# Altium project Safety Thermocouple Interface - No OC detect.PrjPcb
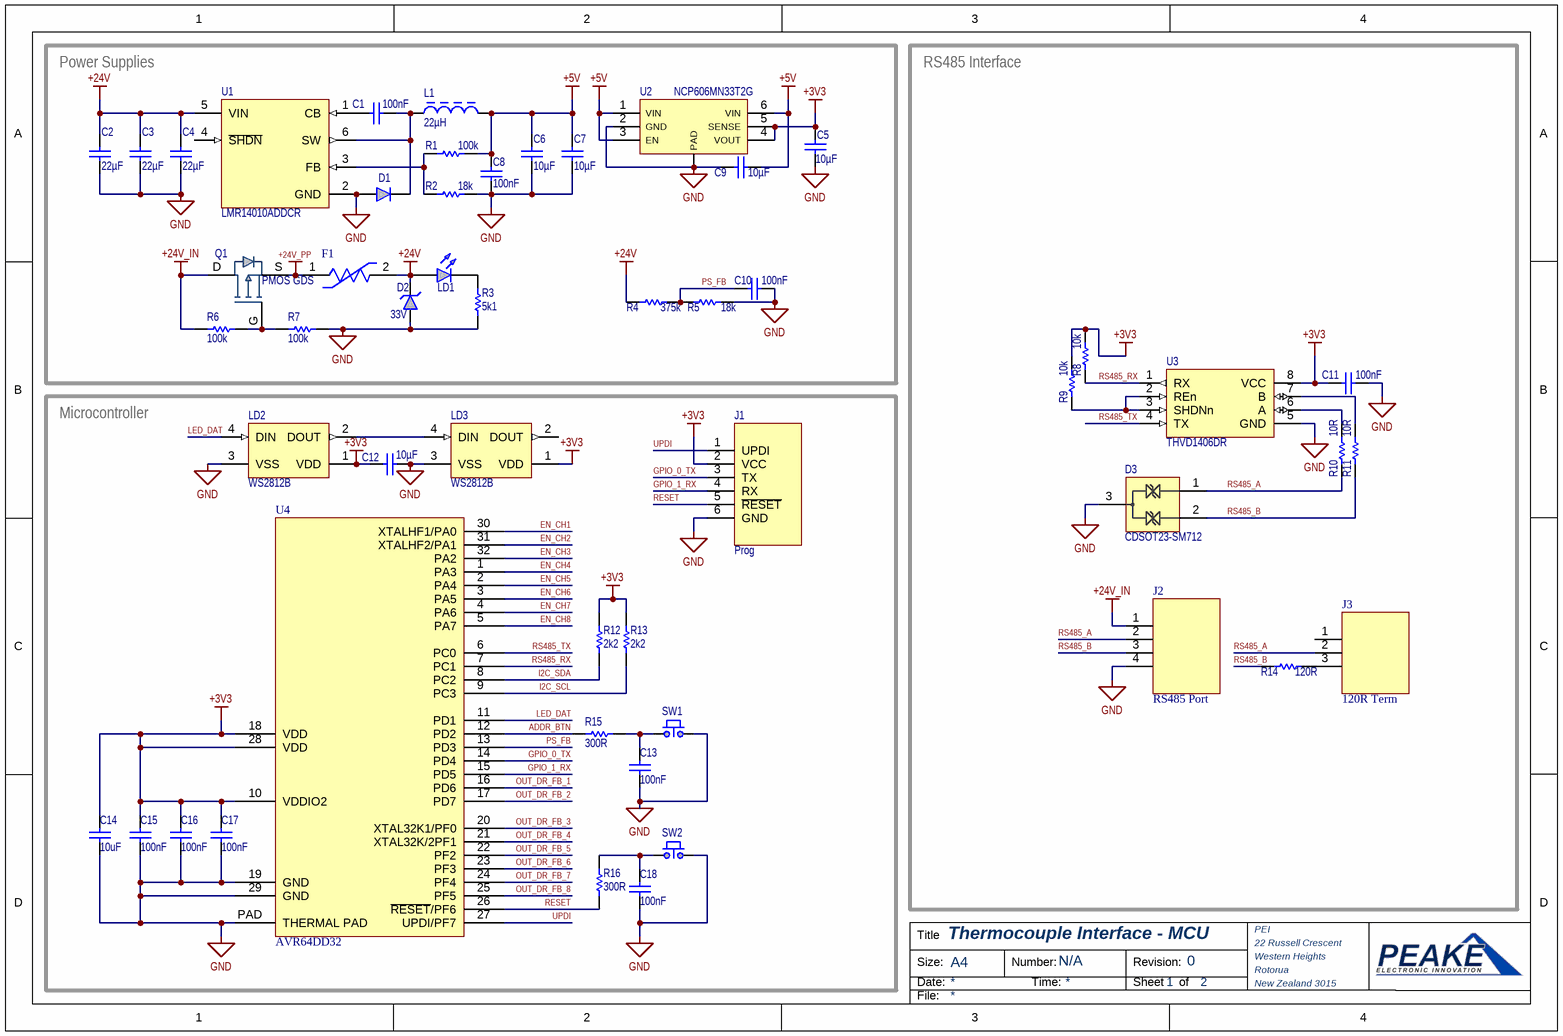
[diagram p0: Safety Thermocouple Interface - MCU.SchDoc]
2 sheets, 184 parts. Net scope: global (net labels, ports and power ports of the same name join across sheets).
Board file: Safety Thermocouple Interface.PcbDoc
Sheets:
  Safety Thermocouple Interface - MCU.SchDoc
  Safety Thermocouple Interface - IO.SchDoc

## Sheet Safety Thermocouple Interface - MCU.SchDoc: Thermocouple Interface - MCU
size A4; Organization: PEI; Address1: 22 Russell Crescent; Address2: Western Heights; Address3: Rotorua; Address4: New Zealand 3015; DocumentNumber: N/A; Revision: 0; SheetNumber: 1; SheetTotal: 2

### Parts
C1  value 100nF  [0603_CAP]  (hidden comment: Capacitor)
C2  value 22µF  [1206_CAP]  (hidden comment: Capacitor)
C3  value 22µF  [1206_CAP]  (hidden comment: Capacitor)
C4  value 22µF  [1206_CAP]  (hidden comment: Capacitor)
C5  value 10µF  [0603_CAP]  (hidden comment: Capacitor)
C6  value 10µF  [0603_CAP]  (hidden comment: Capacitor)
C7  value 10µF  [0603_CAP]  (hidden comment: Capacitor)
C8  value 100nF  [0603_CAP]  (hidden comment: Capacitor)
C9  value 10µF  [0603_CAP]  (hidden comment: Capacitor)
C10  value 100nF  [0603_CAP]  (hidden comment: Capacitor)
C11  value 100nF  [0603_CAP]  (hidden comment: Capacitor)
C12  value 10µF  [0603_CAP]  (hidden comment: Capacitor)
C13  value 100nF  [0603_CAP]  (hidden comment: Capacitor)
C14  value 10uF  [0603_CAP]  (hidden comment: Capacitor)
C15  value 100nF  [0603_CAP]  (hidden comment: Capacitor)
C16  value 100nF  [0603_CAP]  (hidden comment: Capacitor)
C17  value 100nF  [0603_CAP]  (hidden comment: Capacitor)
C18  value 100nF  [0603_CAP]  (hidden comment: Capacitor)
D1  Diode  [SOD-123]  (value not drawn)
D2  Rated Voltage: 33V  [SMBJ]  (hidden comment: Transil)
D3  CDSOT23-SM712  [FP-SOT23-IPC_C]
F1  0ZCF0100AF2A  [FP-0ZCF0100AF2A-MFG]  (value not drawn)
J1  Prog  [DIP6]
J2  RS485 Port  [4_Pin  DB2EVC-3.81-4P-GN LCSC version]
J3  120R Term  [SIP3]
L1  value 22µH  [BOUR-SRN8040_V]  (hidden comment: Inductor)
LD1  LED  [0805]  (value not drawn)
LD2  WS2812B  [WS2812B-2020]
LD3  WS2812B  [WS2812B-2020]
Q1  PMOS GDS  [PowerDI 5060-8]
R1  value 100k  [0603_RES]  (hidden comment: Resistor)
R2  value 18k  [0603_RES]  (hidden comment: Resistor)
R3  value 5k1  [0603_RES]  (hidden comment: Resistor)
R4  value 375k  [0603_RES]  (hidden comment: Resistor)
R5  value 18k  [0603_RES]  (hidden comment: Resistor)
R6  value 100k  [0603_RES]  (hidden comment: Resistor)
R7  value 100k  [0603_RES]  (hidden comment: Resistor)
R8  value 10k  [0603_RES]  (hidden comment: Resistor)
R9  value 10k  [0603_RES]  (hidden comment: Resistor)
R10  value 10R  [0603_RES]  (hidden comment: Resistor)
R11  value 10R  [0603_RES]  (hidden comment: Resistor)
R12  value 2k2  [0603_RES]  (hidden comment: Resistor)
R13  value 2k2  [0603_RES]  (hidden comment: Resistor)
R14  value 120R  [0603_RES]  (hidden comment: Resistor)
R15  value 300R  [0603_RES]  (hidden comment: Resistor)
R16  value 300R  [0603_RES]  (hidden comment: Resistor)
SW1  EVP-AAN02Q  [FP-EVP-AAN02Q-MFG]  (value not drawn)
SW2  EVP-AAN02Q  [FP-EVP-AAN02Q-MFG]  (value not drawn)
U1  LMR14010ADDCR  [FP-DDC0006A-IPC_A]
U2  NCP606MN33T2G  [QFN95P330X295X100_HS-7N]
U3  THVD1406DR  [SOIC127P600X175-8N]
U4  AVR64DD32  [32P VQFN]

### Blocks framed on the sheet
Power Supplies: C1-C10 D1 D2 F1 L1 LD1 Q1 R1-R7 U1 U2
RS485 Interface: C11 D3 J2 J3 R8-R11 R14 U3
Microcontroller: C12-C18 J1 LD2 LD3 R12 R13 R15 R16 SW1 SW2 U4

### Nets
+3V3: C5.1 C11.2 C12.2 C14.2 C15.2 C16.2 C17.2 J1.2(VCC) LD2.1(VDD) LD3.1(VDD) R8.1 R9.1 R12.1 R13.1 U2.4(VOUT) U2.5(SENSE) U3.8(VCC) U4.10(VDDIO2) U4.18(VDD) U4.28(VDD)
+5V: C6.1 C7.1 C8.1 C9.1 L1.2 R1.2 U2.1(VIN) U2.3(EN) U2.6(VIN)
+24V: C2.1 C3.1 C4.1 D2.2(K) F1.2 LD1.2(A) R4.1 U1.5(VIN)
+24V_IN: J2.1 Q1.D R6.1
+24V_PP: F1.1 Q1.S
GND: C2.2 C3.2 C4.2 C5.2 C6.2 C7.2 C8.2 C9.2 C10.2 C11.1 C12.1 C13.1 C14.1 C15.1 C16.1 C17.1 C18.1 D1.2(A) D2.1(A) D3.3 J1.6(GND) J2.4 LD2.3(VSS) LD3.3(VSS) R2.2 R3.2 R5.1 R7.2 SW1.2 SW2.2 U1.2(GND) U2.2(GND) U2.PAD U3.5(GND) U4.19(GND) U4.29(GND) U4.PAD(THERMAL_PAD)
ADDR_BTN: R15.2 U4.12(PD2)
EN_CH1: U4.30(XTALHF1/PA0)
EN_CH2: U4.31(XTALHF2/PA1)
EN_CH3: U4.32(PA2)
EN_CH4: U4.1(PA3)
EN_CH5: U4.2(PA4)
EN_CH6: U4.3(PA5)
EN_CH7: U4.4(PA6)
EN_CH8: U4.5(PA7)
GPIO_0_TX: J1.3(TX) U4.14(PD4)
GPIO_1_RX: J1.4(RX) U4.15(PD5)
I2C_SCL: R13.2 U4.9(PC3)
I2C_SDA: R12.2 U4.8(PC2)
LED_DAT: LD2.4(DIN) U4.11(PD1)
OUT_DR_FB_1: U4.16(PD6)
OUT_DR_FB_2: U4.17(PD7)
OUT_DR_FB_3: U4.20(XTAL32K1/PF0)
OUT_DR_FB_4: U4.21(XTAL32K/2PF1)
OUT_DR_FB_5: U4.22(PF2)
OUT_DR_FB_6: U4.23(PF3)
OUT_DR_FB_7: U4.24(PF4)
OUT_DR_FB_8: U4.25(PF5)
PS_FB: C10.1 R4.2 R5.2 U4.13(PD3)
RESET: J1.5(~{RESET}) R16.1 U4.26(~{RESET}/PF6)
RS485_A: D3.1 J2.2 J3.2 R10.1
RS485_B: D3.2 J2.3 R11.1 R14.1
RS485_RX: R8.2 U3.1(RX) U4.7(PC1)
RS485_TX: U3.4(TX) U4.6(PC0)
UPDI: J1.1(UPDI) U4.27(UPDI/PF7)
NetC1_1: C1.1 D1.1(K) L1.1 U1.6(SW)
NetC1_2: C1.2 U1.1(CB)
NetC13_2: C13.2 R15.1 SW1.1
NetC18_2: C18.2 R16.2 SW2.1
NetJ3_3: J3.3 R14.2
NetLD1_1: LD1.1(K) R3.1
NetLD2_2: LD2.2(DOUT) LD3.4(DIN)
NetQ1_G: Q1.G R6.2 R7.1
NetR1_1: R1.1 R2.1 U1.3(FB)
NetR9_2: R9.2 U3.2(REn) U3.3(SHDNn)
NetR10_2: R10.2 U3.6(A)
NetR11_2: R11.2 U3.7(B)

Not connected (* = marked no-connect by the designer): J3 1; LD3 2(DOUT); U1 4(~{SHDN})

### Notes on the sheet
- Title
- Size:
- Date:
- A4
- Number:
- Time:
- Revision:
- Sheet
- of
- File:

### Library data of the parts
C1-C12 = CMP-001-00172-2: SMD Capacitor; Pins: 2; Source: Discrete.SchLib; Design Item ID: Capacitor; Component Type: Standard
C13-C18 = CMP-001-00172-1: SMD Capacitor; Pins: 2; Source: Discrete.SchLib; Component Type: Standard; Design Item ID: Capacitor
D1 = CMP-004-00083-4: SMD Diode; Design Item ID: Diode; Pins: 2; Source: Discrete.SchLib; Component Type: Standard; Pin Count: 2
D2 = CMP-079-000108-2: Transient Voltage Suppressor; MFN: SMBJ33A; Component Type: Standard; Pin Count: 2; Source: Discrete.SchLib; Breakdown Voltage: *; Design Item ID: Transil; Clamping Voltage: *
D3 = CDSOT23-SM712-3: Trans Voltage Suppressor Diode, 400W, 7V V(RWM), Bidirectional, 2 Element, Silicon; Number of Elements: 2; Min Breakdown Voltage: 7.5V; Qualification Status: Not Qualified; Clamping Voltage-Max: 19V; Reference Standard: IEC-61000-4-2; Package Body Material: Plastic; Technology: AVALANCHE; JESD-30 Code: R-PDSO-G3; Moisture Sensitivity Level: 1; Polarity: Bidirectional; Diode Element Material: SILICON; Rep Pk Reverse Voltage-Max: 7V; JESD-609 Code: e3; Non-rep Peak Rev Power Dis-Max: 400W; Diode Type: TRANS VOLTAGE SUPPRESSOR; Package Style: SMALL OUTLINEMeter; Pins: 3; Surface Mount: Yes; Breakdown Voltage-Nom: 7.5V; Reach SVHC Compliant: Yes; Package Shape: Rectangular; Terminal Form: Gull Wing; RoHS Compliant: Yes; Terminal Position: DUAL; Terminal Finish: Tin
F1 = CMP-005-00014-2: PTC Resettable Fuse 100A 0.5s 60VDC 0.09 Ohm 2-Pin 2920 T/R; Time to Trip: 500ms; Hold Current: 1A; Trip Current: 2A; Pins: 2; Component Type: Standard; Thickness: 0.067inch; Width: 0.202inch; Series: 0ZCF; Max Operating Temperature: 85°C; Source: All Components - 30.06.23 - 18.27.SchLib; Min Operating Temperature: -40°C; Design Item ID: CMP-00051-1; Length: 0.29inch; Case/Package: 2920; RoHS Compliant: Yes; Packaging: Cut Tape; Max Current Rating: 100A; Case Code (Metric): 7351; Mount: Surface Mount
J1 = CMP-002-00180-1: 6 Pin Connector; Component Type: Standard; Design Item ID: 6_Pin; Pins: 6; Source: Connectors.SchLib; Pin Count: 6
J2 = CMP-002-00177-3: 4 Pin Connector; Pins: 4; Design Item ID: 4_Pin; Component Type: Standard; Pin Count: 4; Source: Connectors.SchLib
J3 = CMP-002-00174-3: 3 Pin Connector; Pin Count: 3; Source: Connectors.SchLib; Pins: 3; Component Type: Standard; Design Item ID: 3_Pin
L1 = CMP-006-00052-2: Power Inductor; DCR: 100mR; Current Rating: 2.2A; Pins: 2; Component Type: Standard; Design Item ID: Inductor; Source: Discrete.SchLib; Pin Count: 2; MFN: *
LD1 = CMP-004-00084-3: SMD LED; Colour: RED; Pins: 2; Source: Discrete.SchLib; Design Item ID: LED; Component Type: Standard; Pin Count: 2
LD2 LD3 = CMP-079-000113-2: Intelligent Control LED Integrated Light Source, 3.5 to 5.3 V, -25 to 80 degC, 4-Pin SMD, RoHS, Bulk; Manufacturer: Adafruit Industries; Mounting Technology: SM; RoHS Compliant: False; Package Reference: WS2812B; Case/Package: WS2812B; Component Type: Standard; Manufacturer URL: https://www.adafruit.com/; Package Description: 4-Pin Surface Mount Device, Body 5 x 5 mm, Pitch 3.3 mm; Source: All Components - 30.06.23 - 18.27.SchLib; Datasheet Version: May-13; Datasheet URL: https://cdn-shop.adafruit.com/datasheets/WS2812B.pdf; Pin Count: 4; Design Item ID: CMP-007-00035-3
Q1 = CMP-079-000102-2: P Channel MOSFET; MFN: *; Design Item ID: PMOS GDS; VGS Max: *; Continuous Current: *; VDS Breakdown: *; Source: P-MOS.SchLib; Component Type: Standard; Pin Count: 3
R1-R16 = CMP-009-00356-1: SMD Resistor; Pins: 2; Source: Discrete.SchLib; Component Type: Standard; Design Item ID: Resistor
SW1 SW2 = CMP-011-00000-2: Switch Tactile N.O. SPST Rectangular Button J-Bend 0.02A 15VDC 100000Cycles 5N SMD T/R
U1 = CMP-079-000005-5: 7-40VDC-DC buck converter; Number of Outputs: 1; Max Output Voltage: 40V; Output Current: 1A; Min Input Voltage: 4V; Output Type: Adjustable; Synchronous Rectifier: No; Min Output Voltage: 765mV; Output Configuration: Positive; Switching Frequency: 850kHz; Max Operating Temperature: 125°C; Case/Package: SOT-23-6; Features: UVLO; Pin Count: 6; Packaging: Cut Tape; Mount: Surface Mount; Component Type: Standard; Min Operating Temperature: -40°C; Max Input Voltage: 40V; Source: All Components - 30.06.23 - 18.27.SchLib; Design Item ID: CMP-00007-1
U2 = CMP-019-00001-1: Fixed Positive LDO Regulator, 3.3V, 0.22V Dropout, CMOS; Max Supply Voltage: 6V; RoHS Compliant: Yes; Case/Package: HVSON; Pins: 6
U3 = CMP-015-00008-1: Line Transceiver, 1 Func, 1 Driver, 1 Rcvr, PDSO8; RoHS Compliant: Yes
U4 = CMP-031-00048-2: AVR DD series 24MHz 8-bit 32 pin MCU 1.8-5.5V, multi voltage, 27 GPIO, 64K flash, 8K SRAM, 256b EEPROM.; Source: All Components - 30.06.23 - 18.27.SchLib; Pin Count: 33; Design Item ID: CMP-00041-1; Component Type: Standard

## Sheet Safety Thermocouple Interface - IO.SchDoc: Thermocouple Interface - IO
size A3; Organization: PEI; Address1: 22 Russell Crescent; Address2: Western Heights; Address3: Rotorua; Address4: New Zealand 3015; DocumentNumber: N/A; Revision: 0; SheetNumber: 2; SheetTotal: 2
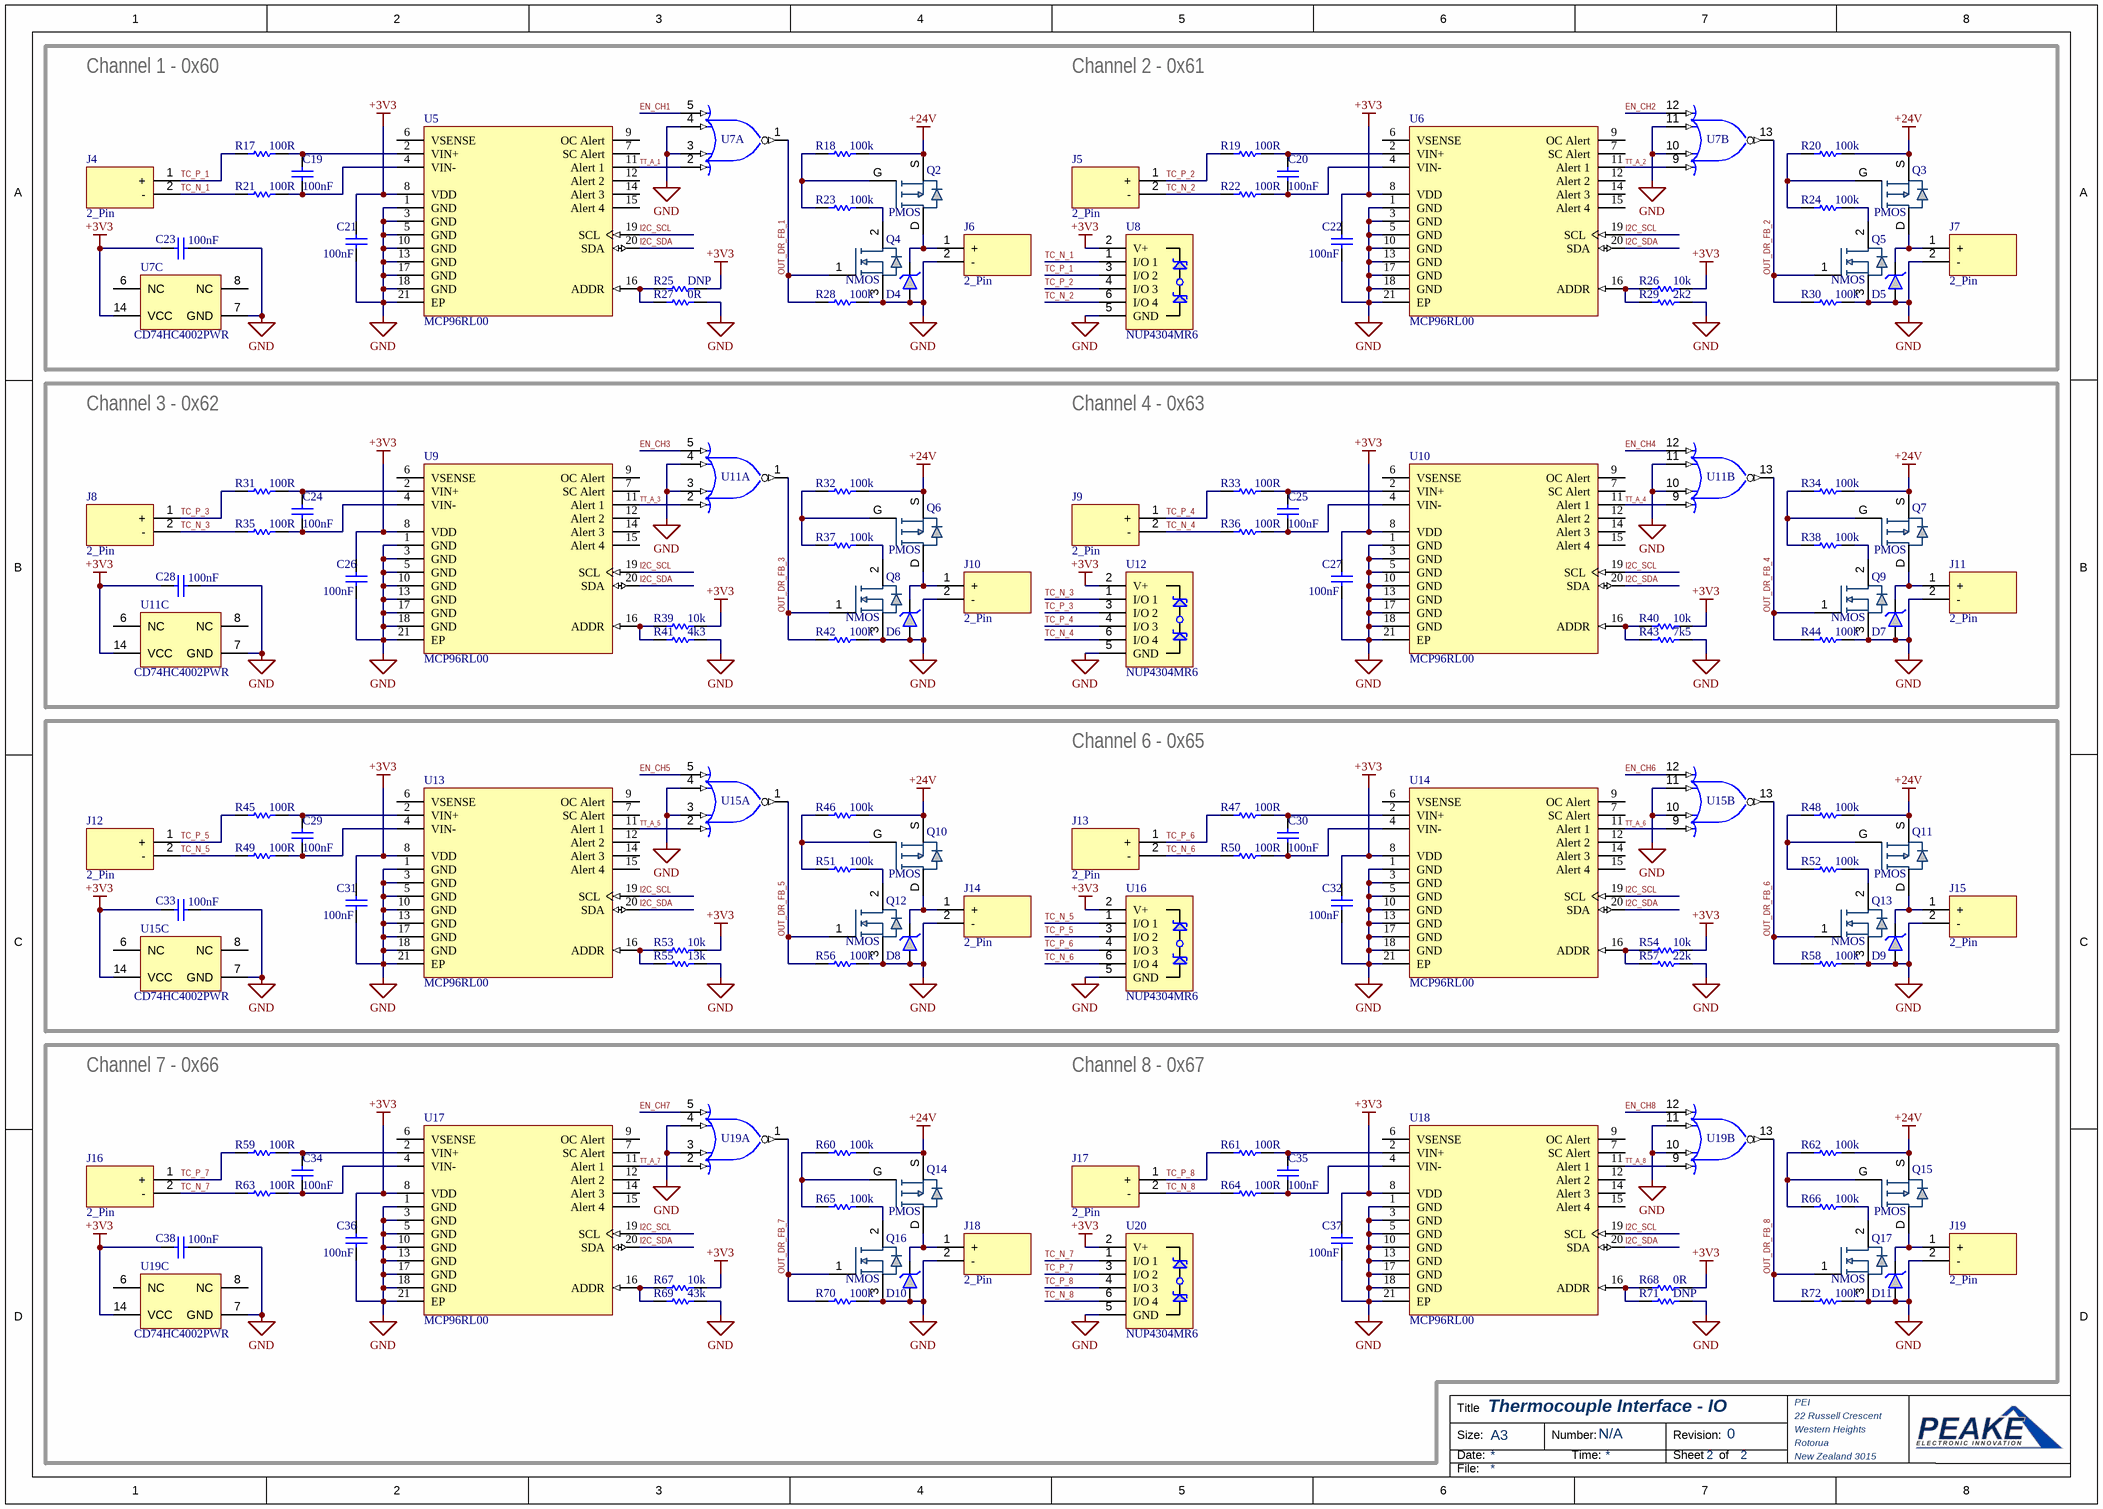
[diagram p1: Safety Thermocouple Interface - IO.SchDoc]

### Parts
C19  value 100nF  [0603_CAP]  (hidden comment: Capacitor)
C20  value 100nF  [0603_CAP]  (hidden comment: Capacitor)
C21  value 100nF  [0603_CAP]  (hidden comment: Capacitor)
C22  value 100nF  [0603_CAP]  (hidden comment: Capacitor)
C23  value 100nF  [0603_CAP]  (hidden comment: Capacitor)
C24  value 100nF  [0603_CAP]  (hidden comment: Capacitor)
C25  value 100nF  [0603_CAP]  (hidden comment: Capacitor)
C26  value 100nF  [0603_CAP]  (hidden comment: Capacitor)
C27  value 100nF  [0603_CAP]  (hidden comment: Capacitor)
C28  value 100nF  [0603_CAP]  (hidden comment: Capacitor)
C29  value 100nF  [0603_CAP]  (hidden comment: Capacitor)
C30  value 100nF  [0603_CAP]  (hidden comment: Capacitor)
C31  value 100nF  [0603_CAP]  (hidden comment: Capacitor)
C32  value 100nF  [0603_CAP]  (hidden comment: Capacitor)
C33  value 100nF  [0603_CAP]  (hidden comment: Capacitor)
C34  value 100nF  [0603_CAP]  (hidden comment: Capacitor)
C35  value 100nF  [0603_CAP]  (hidden comment: Capacitor)
C36  value 100nF  [0603_CAP]  (hidden comment: Capacitor)
C37  value 100nF  [0603_CAP]  (hidden comment: Capacitor)
C38  value 100nF  [0603_CAP]  (hidden comment: Capacitor)
D4  Transil  [SMBJ]  (value not drawn)
D5  Transil  [SMBJ]  (value not drawn)
D6  Transil  [SMBJ]  (value not drawn)
D7  Transil  [SMBJ]  (value not drawn)
D8  Transil  [SMBJ]  (value not drawn)
D9  Transil  [SMBJ]  (value not drawn)
D10  Transil  [SMBJ]  (value not drawn)
D11  Transil  [SMBJ]  (value not drawn)
J4  2_Pin  [2_Pin DB2EVC-3.81-2P-GN]
J5  2_Pin  [2_Pin DB2EVC-3.81-2P-GN]
J6  2_Pin  [2_Pin DB2EVC-3.81-2P-GN]
J7  2_Pin  [2_Pin DB2EVC-3.81-2P-GN]
J8  2_Pin  [2_Pin DB2EVC-3.81-2P-GN]
J9  2_Pin  [2_Pin DB2EVC-3.81-2P-GN]
J10  2_Pin  [2_Pin DB2EVC-3.81-2P-GN]
J11  2_Pin  [2_Pin DB2EVC-3.81-2P-GN]
J12  2_Pin  [2_Pin DB2EVC-3.81-2P-GN]
J13  2_Pin  [2_Pin DB2EVC-3.81-2P-GN]
J14  2_Pin  [2_Pin DB2EVC-3.81-2P-GN]
J15  2_Pin  [2_Pin DB2EVC-3.81-2P-GN]
J16  2_Pin  [2_Pin DB2EVC-3.81-2P-GN]
J17  2_Pin  [2_Pin DB2EVC-3.81-2P-GN]
J18  2_Pin  [2_Pin DB2EVC-3.81-2P-GN]
J19  2_Pin  [2_Pin DB2EVC-3.81-2P-GN]
Q2  PMOS  [PowerDI 5060-8]
Q3  PMOS  [PowerDI 5060-8]
Q4  NMOS  [SOT-23]
Q5  NMOS  [SOT-23]
Q6  PMOS  [PowerDI 5060-8]
Q7  PMOS  [PowerDI 5060-8]
Q8  NMOS  [SOT-23]
Q9  NMOS  [SOT-23]
Q10  PMOS  [PowerDI 5060-8]
Q11  PMOS  [PowerDI 5060-8]
Q12  NMOS  [SOT-23]
Q13  NMOS  [SOT-23]
Q14  PMOS  [PowerDI 5060-8]
Q15  PMOS  [PowerDI 5060-8]
Q16  NMOS  [SOT-23]
Q17  NMOS  [SOT-23]
R17  value 100R  [0603_RES]  (hidden comment: Resistor)
R18  value 100k  [0603_RES]  (hidden comment: Resistor)
R19  value 100R  [0603_RES]  (hidden comment: Resistor)
R20  value 100k  [0603_RES]  (hidden comment: Resistor)
R21  value 100R  [0603_RES]  (hidden comment: Resistor)
R22  value 100R  [0603_RES]  (hidden comment: Resistor)
R23  value 100k  [0603_RES]  (hidden comment: Resistor)
R24  value 100k  [0603_RES]  (hidden comment: Resistor)
R25  value DNP  [0603_RES]  (hidden comment: Resistor)
R26  value 10k  [0603_RES]  (hidden comment: Resistor)
R27  value 0R  [0603_RES]  (hidden comment: Resistor)
R28  value 100k  [0603_RES]  (hidden comment: Resistor)
R29  value 2k2  [0603_RES]  (hidden comment: Resistor)
R30  value 100k  [0603_RES]  (hidden comment: Resistor)
R31  value 100R  [0603_RES]  (hidden comment: Resistor)
R32  value 100k  [0603_RES]  (hidden comment: Resistor)
R33  value 100R  [0603_RES]  (hidden comment: Resistor)
R34  value 100k  [0603_RES]  (hidden comment: Resistor)
R35  value 100R  [0603_RES]  (hidden comment: Resistor)
R36  value 100R  [0603_RES]  (hidden comment: Resistor)
R37  value 100k  [0603_RES]  (hidden comment: Resistor)
R38  value 100k  [0603_RES]  (hidden comment: Resistor)
R39  value 10k  [0603_RES]  (hidden comment: Resistor)
R40  value 10k  [0603_RES]  (hidden comment: Resistor)
R41  value 4k3  [0603_RES]  (hidden comment: Resistor)
R42  value 100k  [0603_RES]  (hidden comment: Resistor)
R43  value 7k5  [0603_RES]  (hidden comment: Resistor)
R44  value 100k  [0603_RES]  (hidden comment: Resistor)
R45  value 100R  [0603_RES]  (hidden comment: Resistor)
R46  value 100k  [0603_RES]  (hidden comment: Resistor)
R47  value 100R  [0603_RES]  (hidden comment: Resistor)
R48  value 100k  [0603_RES]  (hidden comment: Resistor)
R49  value 100R  [0603_RES]  (hidden comment: Resistor)
R50  value 100R  [0603_RES]  (hidden comment: Resistor)
R51  value 100k  [0603_RES]  (hidden comment: Resistor)
R52  value 100k  [0603_RES]  (hidden comment: Resistor)
R53  value 10k  [0603_RES]  (hidden comment: Resistor)
R54  value 10k  [0603_RES]  (hidden comment: Resistor)
R55  value 13k  [0603_RES]  (hidden comment: Resistor)
R56  value 100k  [0603_RES]  (hidden comment: Resistor)
R57  value 22k  [0603_RES]  (hidden comment: Resistor)
R58  value 100k  [0603_RES]  (hidden comment: Resistor)
R59  value 100R  [0603_RES]  (hidden comment: Resistor)
R60  value 100k  [0603_RES]  (hidden comment: Resistor)
R61  value 100R  [0603_RES]  (hidden comment: Resistor)
R62  value 100k  [0603_RES]  (hidden comment: Resistor)
R63  value 100R  [0603_RES]  (hidden comment: Resistor)
R64  value 100R  [0603_RES]  (hidden comment: Resistor)
R65  value 100k  [0603_RES]  (hidden comment: Resistor)
R66  value 100k  [0603_RES]  (hidden comment: Resistor)
R67  value 10k  [0603_RES]  (hidden comment: Resistor)
R68  value 0R  [0603_RES]  (hidden comment: Resistor)
R69  value 43k  [0603_RES]  (hidden comment: Resistor)
R70  value 100k  [0603_RES]  (hidden comment: Resistor)
R71  value DNP  [0603_RES]  (hidden comment: Resistor)
R72  value 100k  [0603_RES]  (hidden comment: Resistor)
U5  MCP96RL00  [FP-C04-186-IPC_B]
U6  MCP96RL00  [FP-C04-186-IPC_B]
U7  CD74HC4002PWR  [PW0014A_N]  (value not drawn)  (parts A,B,C of 3)
U8  NUP4304MR6  [TSOP-6]
U9  MCP96RL00  [FP-C04-186-IPC_B]
U10  MCP96RL00  [FP-C04-186-IPC_B]
U11  CD74HC4002PWR  [PW0014A_N]  (value not drawn)  (parts A,B,C of 3)
U12  NUP4304MR6  [TSOP-6]
U13  MCP96RL00  [FP-C04-186-IPC_B]
U14  MCP96RL00  [FP-C04-186-IPC_B]
U15  CD74HC4002PWR  [PW0014A_N]  (value not drawn)  (parts A,B,C of 3)
U16  NUP4304MR6  [TSOP-6]
U17  MCP96RL00  [FP-C04-186-IPC_B]
U18  MCP96RL00  [FP-C04-186-IPC_B]
U19  CD74HC4002PWR  [PW0014A_N]  (value not drawn)  (parts A,B,C of 3)
U20  NUP4304MR6  [TSOP-6]

### Blocks framed on the sheet
Channel 6 - 0x65: C29-C33 D8 D9 J12-J15 Q10-Q13 R45-R58 U13-U16

### Nets
+3V3: C21.2 C22.2 C23.2 C26.2 C27.2 C28.2 C31.2 C32.2 C33.2 C36.2 C37.2 C38.2 R25.1 R26.1 R39.1 R40.1 R53.1 R54.1 R67.1 R68.1 U5.8(VDD) U6.8(VDD) U7.14(VCC) U8.2(V+) U9.8(VDD) U10.8(VDD) U11.14(VCC) U12.2(V+) U13.8(VDD) U14.8(VDD) U15.14(VCC) U16.2(V+) U17.8(VDD) U18.8(VDD) U19.14(VCC) U20.2(V+)
+24V: Q2.S Q3.S Q6.S Q7.S Q10.S Q11.S Q14.S Q15.S R18.1 R20.1 R32.1 R34.1 R46.1 R48.1 R60.1 R62.1
GND: C21.1 C22.1 C23.1 C26.1 C27.1 C28.1 C31.1 C32.1 C33.1 C36.1 C37.1 C38.1 D4.1(A) D5.1(A) D6.1(A) D7.1(A) D8.1(A) D9.1(A) D10.1(A) D11.1(A) J6.2(-) J7.2(-) J10.2(-) J11.2(-) J14.2(-) J15.2(-) J18.2(-) J19.2(-) Q4.3(S) Q5.3(S) Q8.3(S) Q9.3(S) Q12.3(S) Q13.3(S) Q16.3(S) Q17.3(S) R27.1 R28.1 R29.1 R30.1 R41.1 R42.1 R43.1 R44.1 R55.1 R56.1 R57.1 R58.1 R69.1 R70.1 R71.1 R72.1 U5.1(GND) U5.3(GND) U5.5(GND) U5.10(GND) U5.13(GND) U5.17(GND) U5.18(GND) U5.21(EP) U6.1(GND) U6.3(GND) U6.5(GND) U6.10(GND) U6.13(GND) U6.17(GND) U6.18(GND) U6.21(EP) U7.3(1B) U7.4(1C) U7.7(GND) U7.10(2B) U7.11(2C) U8.5(GND) U9.1(GND) U9.3(GND) U9.5(GND) U9.10(GND) U9.13(GND) U9.17(GND) U9.18(GND) U9.21(EP) U10.1(GND) U10.3(GND) U10.5(GND) U10.10(GND) U10.13(GND) U10.17(GND) U10.18(GND) U10.21(EP) U11.3(1B) U11.4(1C) U11.7(GND) U11.10(2B) U11.11(2C) U12.5(GND) U13.1(GND) U13.3(GND) U13.5(GND) U13.10(GND) U13.13(GND) U13.17(GND) U13.18(GND) U13.21(EP) U14.1(GND) U14.3(GND) U14.5(GND) U14.10(GND) U14.13(GND) U14.17(GND) U14.18(GND) U14.21(EP) U15.3(1B) U15.4(1C) U15.7(GND) U15.10(2B) U15.11(2C) U16.5(GND) U17.1(GND) U17.3(GND) U17.5(GND) U17.10(GND) U17.13(GND) U17.17(GND) U17.18(GND) U17.21(EP) U18.1(GND) U18.3(GND) U18.5(GND) U18.10(GND) U18.13(GND) U18.17(GND) U18.18(GND) U18.21(EP) U19.3(1B) U19.4(1C) U19.7(GND) U19.10(2B) U19.11(2C) U20.5(GND)
EN_CH1: U7.5(1D)
EN_CH2: U7.12(2D)
EN_CH3: U11.5(1D)
EN_CH4: U11.12(2D)
EN_CH5: U15.5(1D)
EN_CH6: U15.12(2D)
EN_CH7: U19.5(1D)
EN_CH8: U19.12(2D)
I2C_SCL: U5.19(SCL) U6.19(SCL) U9.19(SCL) U10.19(SCL) U13.19(SCL) U14.19(SCL) U17.19(SCL) U18.19(SCL)
I2C_SDA: U5.20(SDA) U6.20(SDA) U9.20(SDA) U10.20(SDA) U13.20(SDA) U14.20(SDA) U17.20(SDA) U18.20(SDA)
OUT_DR_FB_1: Q4.1(G) R28.2 U7.1(1Y)
OUT_DR_FB_2: Q5.1(G) R30.2 U7.13(2Y)
OUT_DR_FB_3: Q8.1(G) R42.2 U11.1(1Y)
OUT_DR_FB_4: Q9.1(G) R44.2 U11.13(2Y)
OUT_DR_FB_5: Q12.1(G) R56.2 U15.1(1Y)
OUT_DR_FB_6: Q13.1(G) R58.2 U15.13(2Y)
OUT_DR_FB_7: Q16.1(G) R70.2 U19.1(1Y)
OUT_DR_FB_8: Q17.1(G) R72.2 U19.13(2Y)
TC_N_1: J4.2(-) R21.2 U8.1(I/O_1)
TC_N_2: J5.2(-) R22.2 U8.6(I/O_4)
TC_N_3: J8.2(-) R35.2 U12.1(I/O_1)
TC_N_4: J9.2(-) R36.2 U12.6(I/O_4)
TC_N_5: J12.2(-) R49.2 U16.1(I/O_1)
TC_N_6: J13.2(-) R50.2 U16.6(I/O_4)
TC_N_7: J16.2(-) R63.2 U20.1(I/O_1)
TC_N_8: J17.2(-) R64.2 U20.6(I/O_4)
TC_P_1: J4.1(+) R17.2 U8.3(I/O_2)
TC_P_2: J5.1(+) R19.2 U8.4(I/O_3)
TC_P_3: J8.1(+) R31.2 U12.3(I/O_2)
TC_P_4: J9.1(+) R33.2 U12.4(I/O_3)
TC_P_5: J12.1(+) R45.2 U16.3(I/O_2)
TC_P_6: J13.1(+) R47.2 U16.4(I/O_3)
TC_P_7: J16.1(+) R59.2 U20.3(I/O_2)
TC_P_8: J17.1(+) R61.2 U20.4(I/O_3)
TT_A_1: U5.11(Alert_1) U7.2(1A)
TT_A_2: U6.11(Alert_1) U7.9(2A)
TT_A_3: U9.11(Alert_1) U11.2(1A)
TT_A_4: U10.11(Alert_1) U11.9(2A)
TT_A_5: U13.11(Alert_1) U15.2(1A)
TT_A_6: U14.11(Alert_1) U15.9(2A)
TT_A_7: U17.11(Alert_1) U19.2(1A)
TT_A_8: U18.11(Alert_1) U19.9(2A)
NetC19_1: C19.1 R21.1 U5.4(VIN-)
NetC19_2: C19.2 R17.1 U5.2(VIN+)
NetC20_1: C20.1 R22.1 U6.4(VIN-)
NetC20_2: C20.2 R19.1 U6.2(VIN+)
NetC24_1: C24.1 R35.1 U9.4(VIN-)
NetC24_2: C24.2 R31.1 U9.2(VIN+)
NetC25_1: C25.1 R36.1 U10.4(VIN-)
NetC25_2: C25.2 R33.1 U10.2(VIN+)
NetC29_1: C29.1 R49.1 U13.4(VIN-)
NetC29_2: C29.2 R45.1 U13.2(VIN+)
NetC30_1: C30.1 R50.1 U14.4(VIN-)
NetC30_2: C30.2 R47.1 U14.2(VIN+)
NetC34_1: C34.1 R63.1 U17.4(VIN-)
NetC34_2: C34.2 R59.1 U17.2(VIN+)
NetC35_1: C35.1 R64.1 U18.4(VIN-)
NetC35_2: C35.2 R61.1 U18.2(VIN+)
NetD4_2: D4.2(K) J6.1(+) Q2.D
NetD5_2: D5.2(K) J7.1(+) Q3.D
NetD6_2: D6.2(K) J10.1(+) Q6.D
NetD7_2: D7.2(K) J11.1(+) Q7.D
NetD8_2: D8.2(K) J14.1(+) Q10.D
NetD9_2: D9.2(K) J15.1(+) Q11.D
NetD10_2: D10.2(K) J18.1(+) Q14.D
NetD11_2: D11.2(K) J19.1(+) Q15.D
NetQ2_G: Q2.G R18.2 R23.2
NetQ3_G: Q3.G R20.2 R24.2
NetQ4_2: Q4.2(D) R23.1
NetQ5_2: Q5.2(D) R24.1
NetQ6_G: Q6.G R32.2 R37.2
NetQ7_G: Q7.G R34.2 R38.2
NetQ8_2: Q8.2(D) R37.1
NetQ9_2: Q9.2(D) R38.1
NetQ10_G: Q10.G R46.2 R51.2
NetQ11_G: Q11.G R48.2 R52.2
NetQ12_2: Q12.2(D) R51.1
NetQ13_2: Q13.2(D) R52.1
NetQ14_G: Q14.G R60.2 R65.2
NetQ15_G: Q15.G R62.2 R66.2
NetQ16_2: Q16.2(D) R65.1
NetQ17_2: Q17.2(D) R66.1
NetR25_2: R25.2 R27.2 U5.16(ADDR)
NetR26_2: R26.2 R29.2 U6.16(ADDR)
NetR39_2: R39.2 R41.2 U9.16(ADDR)
NetR40_2: R40.2 R43.2 U10.16(ADDR)
NetR53_2: R53.2 R55.2 U13.16(ADDR)
NetR54_2: R54.2 R57.2 U14.16(ADDR)
NetR67_2: R67.2 R69.2 U17.16(ADDR)
NetR68_2: R68.2 R71.2 U18.16(ADDR)

Not connected (* = marked no-connect by the designer): U5 6(VSENSE) 7(SC_Alert) 9(OC_Alert) 12(Alert_2) 14(Alert_3) 15(Alert_4); U6 6(VSENSE) 7(SC_Alert) 9(OC_Alert) 12(Alert_2) 14(Alert_3) 15(Alert_4); U7 6(NC) 8(NC); U9 6(VSENSE) 7(SC_Alert) 9(OC_Alert) 12(Alert_2) 14(Alert_3) 15(Alert_4); U10 6(VSENSE) 7(SC_Alert) 9(OC_Alert) 12(Alert_2) 14(Alert_3) 15(Alert_4); U11 6(NC) 8(NC); U13 6(VSENSE) 7(SC_Alert) 9(OC_Alert) 12(Alert_2) 14(Alert_3) 15(Alert_4); U14 6(VSENSE) 7(SC_Alert) 9(OC_Alert) 12(Alert_2) 14(Alert_3) 15(Alert_4); U15 6(NC) 8(NC); U17 6(VSENSE) 7(SC_Alert) 9(OC_Alert) 12(Alert_2) 14(Alert_3) 15(Alert_4); U18 6(VSENSE) 7(SC_Alert) 9(OC_Alert) 12(Alert_2) 14(Alert_3) 15(Alert_4); U19 6(NC) 8(NC)

### Notes on the sheet
- Channel 1 - 0x60
- Channel 2 - 0x61
- Channel 3 - 0x62
- Channel 4 - 0x63
- Channel 7 - 0x66
- Channel 8 - 0x67
- Title
- Size:
- Date:
- A3
- Number:
- Time:
- Revision:
- Sheet
- of
- File:

### Library data of the parts
C19-C38 = CMP-001-00172-2: SMD Capacitor; Pins: 2; Source: Discrete.SchLib; Design Item ID: Capacitor; Component Type: Standard
D4-D11 = CMP-079-000108-2: Transient Voltage Suppressor; Component Type: Standard; Rated Voltage: *; Pin Count: 2; Source: Discrete.SchLib; Breakdown Voltage: *; Design Item ID: Transil; MFN: *; Clamping Voltage: *
J4-J19 = CMP-002-00173-4: 2 Pin Connector; Source: Connectors.SchLib; Component Type: Standard; Pin Count: 2; MFN: *; Pins: 2; Design Item ID: 2_Pin
Q2 Q3 Q6 Q7 Q10 Q11 Q14 Q15 = CMP-079-000102-2: P Channel MOSFET; MFN: *; Design Item ID: PMOS GDS; VGS Max: *; Continuous Current: *; VDS Breakdown: *; Source: P-MOS.SchLib; Component Type: Standard; Pin Count: 3
Q4 Q5 Q8 Q9 Q12 Q13 Q16 Q17 = CMP-079-000093-2: N Channel MOSFET; Design Item ID: NMOS; Source: N-MOS.SchLib; MFN: *; Pin Count: 3; Component Type: Standard
R17-R72 = CMP-009-00356-3: SMD Resistor; Pins: 2; Component Type: Standard; Design Item ID: Resistor; Source: Discrete.SchLib
U5 U6 U9 U10 U13 U14 U17 U18 = CMP-015-00011-2: Analog Circuit
U7 U11 U15 U19 = CMP-016-00000-1: NOR Gate, HC Series, 2-Func, 4-Input, CMOS, PDSO14; Nominal Supply Voltage: 4.5V; Max Supply Voltage: 6V; Min Supply Voltage: 2V; Min Operating Temperature: -55°C; Pins: 14; Logic Type: NOR GATE; Max Operating Temperature: 125°C; RoHS Compliant: Yes; Case/Package: TSSOP
U8 U12 U16 U20 = CMP-079-000096-2: ESD Protection Doide Array; Design Item ID: NUP4304MR6; Pin Count: 6; Component Type: Standard; Source: ON Semi.SchLib

## Nets that join several sheets
+3V3: Safety Thermocouple Interface - MCU (20 pins), Safety Thermocouple Interface - IO (36 pins)
+24V: Safety Thermocouple Interface - MCU (8 pins), Safety Thermocouple Interface - IO (16 pins)
GND: Safety Thermocouple Interface - MCU (37 pins), Safety Thermocouple Interface - IO (140 pins)
EN_CH1: Safety Thermocouple Interface - MCU (U4.30), Safety Thermocouple Interface - IO (U7.5)
EN_CH2: Safety Thermocouple Interface - MCU (U4.31), Safety Thermocouple Interface - IO (U7.12)
EN_CH3: Safety Thermocouple Interface - MCU (U4.32), Safety Thermocouple Interface - IO (U11.5)
EN_CH4: Safety Thermocouple Interface - MCU (U4.1), Safety Thermocouple Interface - IO (U11.12)
EN_CH5: Safety Thermocouple Interface - MCU (U4.2), Safety Thermocouple Interface - IO (U15.5)
EN_CH6: Safety Thermocouple Interface - MCU (U4.3), Safety Thermocouple Interface - IO (U15.12)
EN_CH7: Safety Thermocouple Interface - MCU (U4.4), Safety Thermocouple Interface - IO (U19.5)
EN_CH8: Safety Thermocouple Interface - MCU (U4.5), Safety Thermocouple Interface - IO (U19.12)
I2C_SCL: Safety Thermocouple Interface - MCU (R13.2 U4.9), Safety Thermocouple Interface - IO (8 pins)
I2C_SDA: Safety Thermocouple Interface - MCU (R12.2 U4.8), Safety Thermocouple Interface - IO (8 pins)
OUT_DR_FB_1: Safety Thermocouple Interface - MCU (U4.16), Safety Thermocouple Interface - IO (Q4.1 R28.2 U7.1)
OUT_DR_FB_2: Safety Thermocouple Interface - MCU (U4.17), Safety Thermocouple Interface - IO (Q5.1 R30.2 U7.13)
OUT_DR_FB_3: Safety Thermocouple Interface - MCU (U4.20), Safety Thermocouple Interface - IO (Q8.1 R42.2 U11.1)
OUT_DR_FB_4: Safety Thermocouple Interface - MCU (U4.21), Safety Thermocouple Interface - IO (Q9.1 R44.2 U11.13)
OUT_DR_FB_5: Safety Thermocouple Interface - MCU (U4.22), Safety Thermocouple Interface - IO (Q12.1 R56.2 U15.1)
OUT_DR_FB_6: Safety Thermocouple Interface - MCU (U4.23), Safety Thermocouple Interface - IO (Q13.1 R58.2 U15.13)
OUT_DR_FB_7: Safety Thermocouple Interface - MCU (U4.24), Safety Thermocouple Interface - IO (Q16.1 R70.2 U19.1)
OUT_DR_FB_8: Safety Thermocouple Interface - MCU (U4.25), Safety Thermocouple Interface - IO (Q17.1 R72.2 U19.13)